# EAGLE schematic motor_driver (EAGLE 8.3.2)
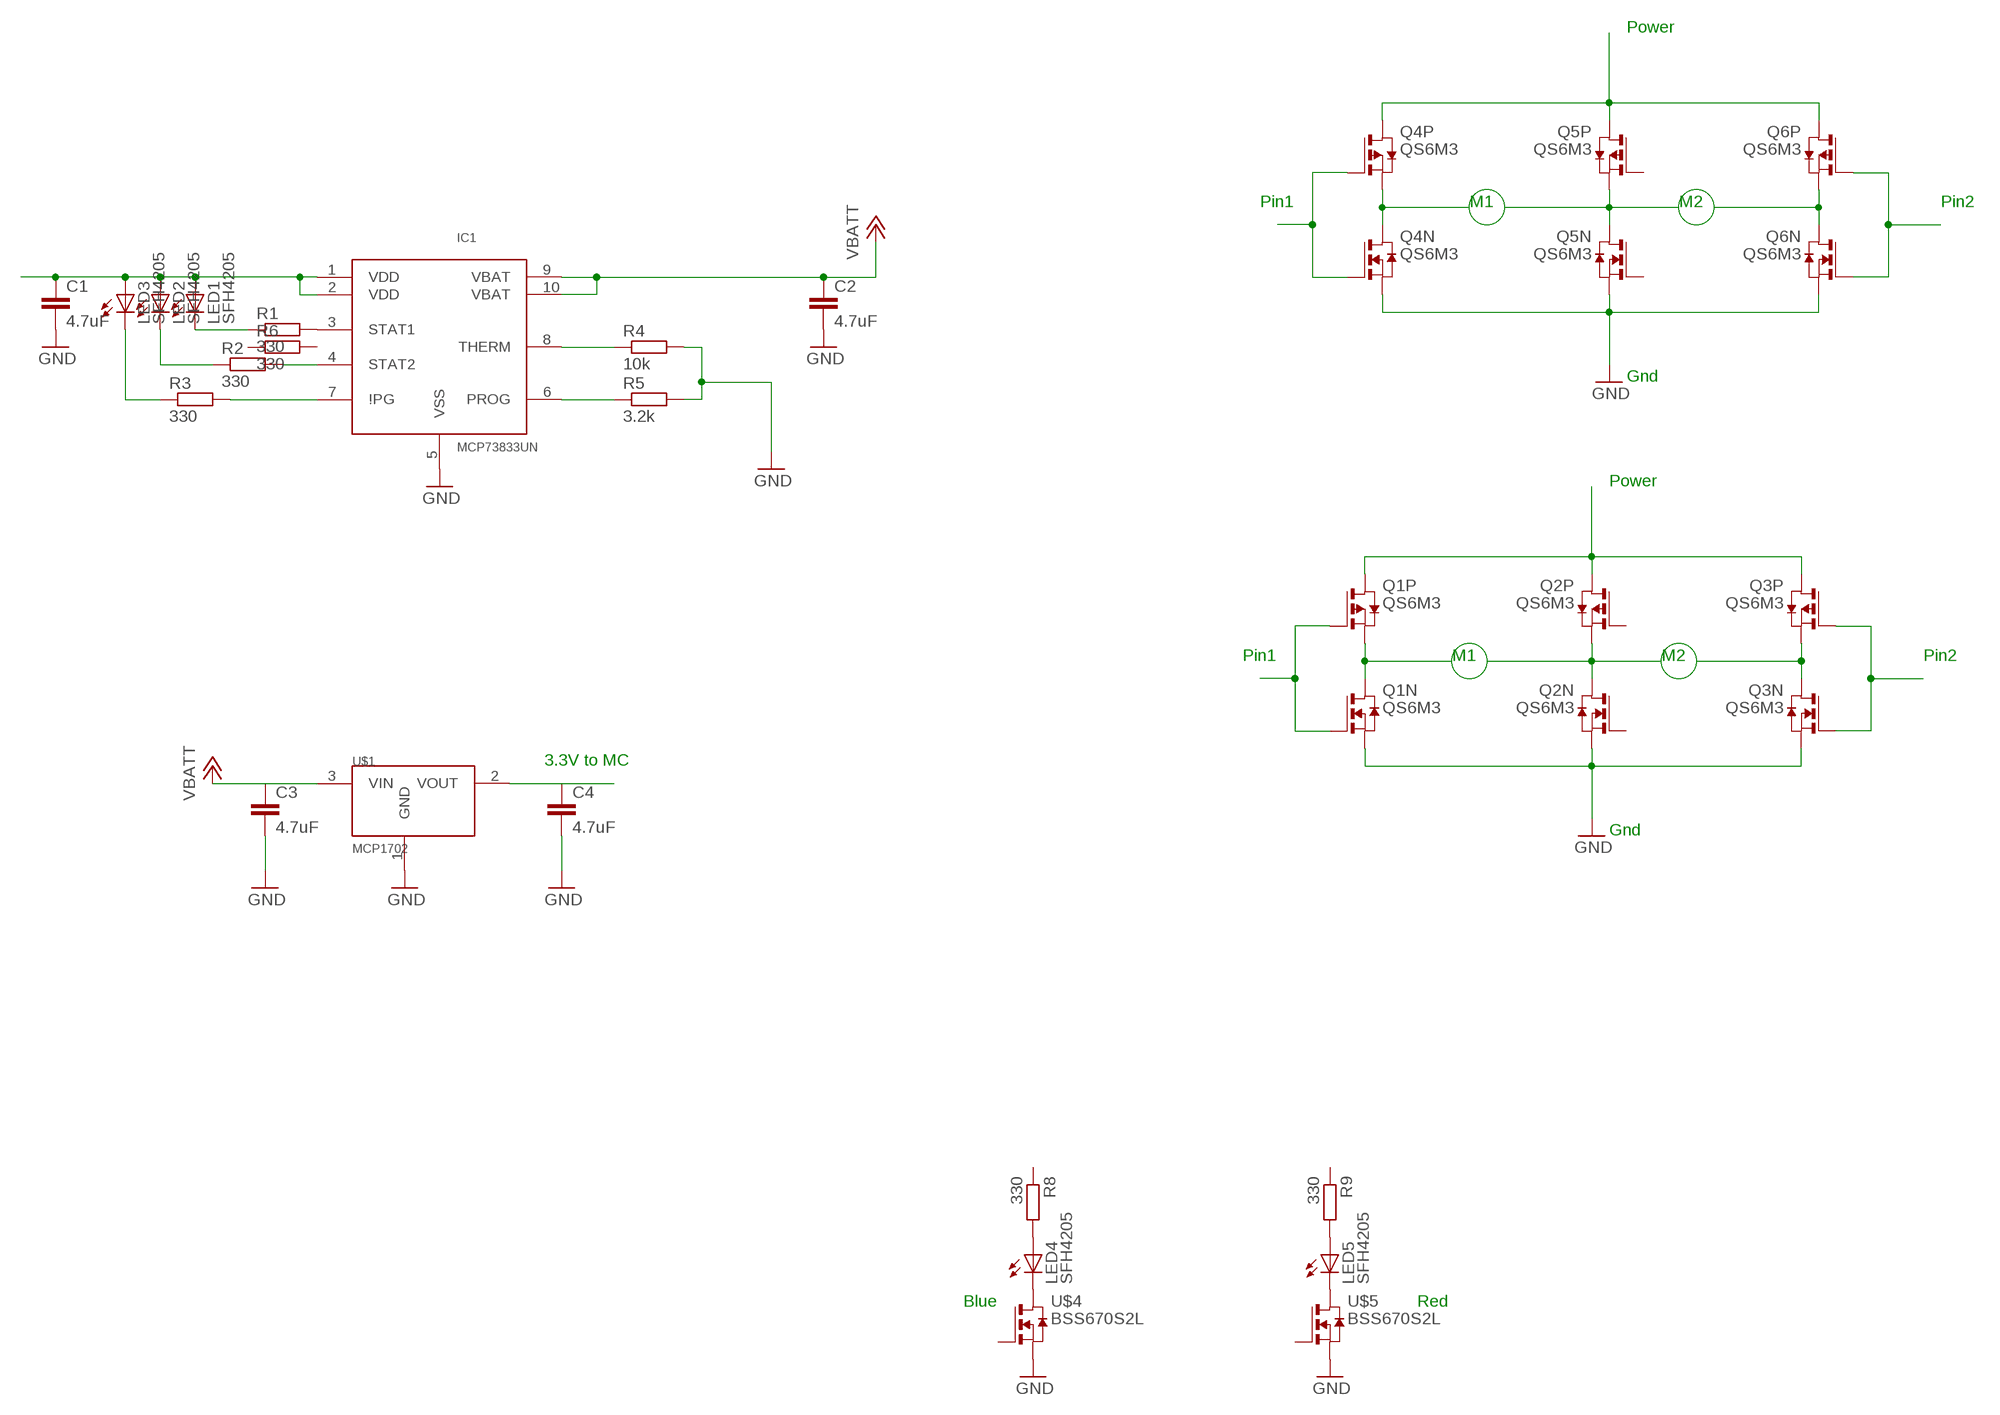
[diagram p0: schematic, sheet 1]

## Parts
C1  4.7uF  C2,5-3  [C2.5-3]
C2  4.7uF  C2,5-3  [C2.5-3]
C3  4.7uF  C2,5-3  [C2.5-3]
C4  4.7uF  C2,5-3  [C2.5-3]
IC1  MCP73833UN  [MSOP10]
LED1  SFH4205  [SFH4205]
LED2  SFH4205  [SFH4205]
LED3  SFH4205  [SFH4205]
LED4  SFH4205  [SFH4205]
LED5  SFH4205  [SFH4205]
Q1  QS6M3  [SOT23-6]
Q2  QS6M3  [SOT23-6]
Q3  QS6M3  [SOT23-6]
Q4  QS6M3  [SOT23-6]
Q5  QS6M3  [SOT23-6]
Q6  QS6M3  [SOT23-6]
R1  330  R-EU_0207/5V  [0207/5V]
R2  330  R-EU_0207/5V  [0207/5V]
R3  330  R-EU_0207/5V  [0207/5V]
R4  10k  R-EU_0207/5V  [0207/5V]
R5  3.2k  R-EU_0207/5V  [0207/5V]
R6  330  R-EU_0207/5V  [0207/5V]
R8  330  R-EU_0207/5V  [0207/5V]
R9  330  R-EU_0207/5V  [0207/5V]
U$1  MCP1702  [SOT23-3L]
U$4  BSS670S2L  [SOT23-3L]
U$5  BSS670S2L  [SOT23-3L]

## Nets
GND: C1.2 C2.2 C3.2 C4.2 IC1.5(VSS) R4.2 R5.2 U$1.1(GND)
N$1: Q1.2(P:S) Q1.6(N:D)
N$2: Q1.5(N:S) Q2.5(N:S) Q3.5(N:S)
N$3: Q3.2(P:S) Q3.6(N:D)
N$4: Q2.2(P:S) Q2.6(N:D)
N$5: Q1.4(P:D) Q2.4(P:D) Q3.4(P:D)
N$6: Q1.1(N:G) Q1.3(P:G)
N$7: Q3.1(N:G) Q3.3(P:G)
N$8: Q4.2(P:S) Q4.6(N:D)
N$9: Q4.5(N:S) Q5.5(N:S) Q6.5(N:S)
N$10: Q6.2(P:S) Q6.6(N:D)
N$11: Q5.2(P:S) Q5.6(N:D)
N$12: Q4.4(P:D) Q5.4(P:D) Q6.4(P:D)
N$13: Q4.1(N:G) Q4.3(P:G)
N$14: Q6.1(N:G) Q6.3(P:G)
N$15: C1.1 IC1.1(VDD) IC1.2(VDD) LED1.A LED2.A LED3.A
N$16: IC1.3(STAT1) R1.2
N$17: LED1.K R1.1
N$18: LED2.K R2.1
N$19: LED3.K R3.1
N$20: IC1.7(\!PG) R3.2
N$21: IC1.4(STAT2) R2.2
N$22: IC1.8(THERM) R4.1
N$23: IC1.6(PROG) R5.1
N$24: LED4.K U$4.3(D)
N$25: LED5.K U$5.3(D)
N$26: U$1.2(VOUT)
N$27: LED4.A R8.2
VBATT: C2.1 IC1.9(VBAT) IC1.10(VBAT) U$1.3(VIN)
Unconnected: C3.1 C4.1 LED5.A Q2.1(N:G) Q2.3(P:G) Q5.1(N:G) Q5.3(P:G) R6.1 R6.2 R8.1 R9.1 R9.2 U$4.1(G) U$4.2(S) U$5.1(G) U$5.2(S)

## Notes on the sheet
- Power
- Pin1 | M1 | M2 | Pin2
- Gnd
- Power
- Pin1 | M1 | M2 | Pin2
- 3.3V to MC
- Gnd
- Blue | Red

## Library data of the parts
C1-C4 = capacitor-wima:C: CAPACITOR naming: grid - package width
IC1 = formica:MCP73833
LED1-LED5 = formica:SFH4205
Q1-Q6 = formica:QS6M3
R1-R6 R8 R9 = resistor:R-EU_: RESISTOR, European symbol
U$1 = formica:MCP1702
U$4 U$5 = formica:BSS670S2L